# Altium project Board2.PrjPcb
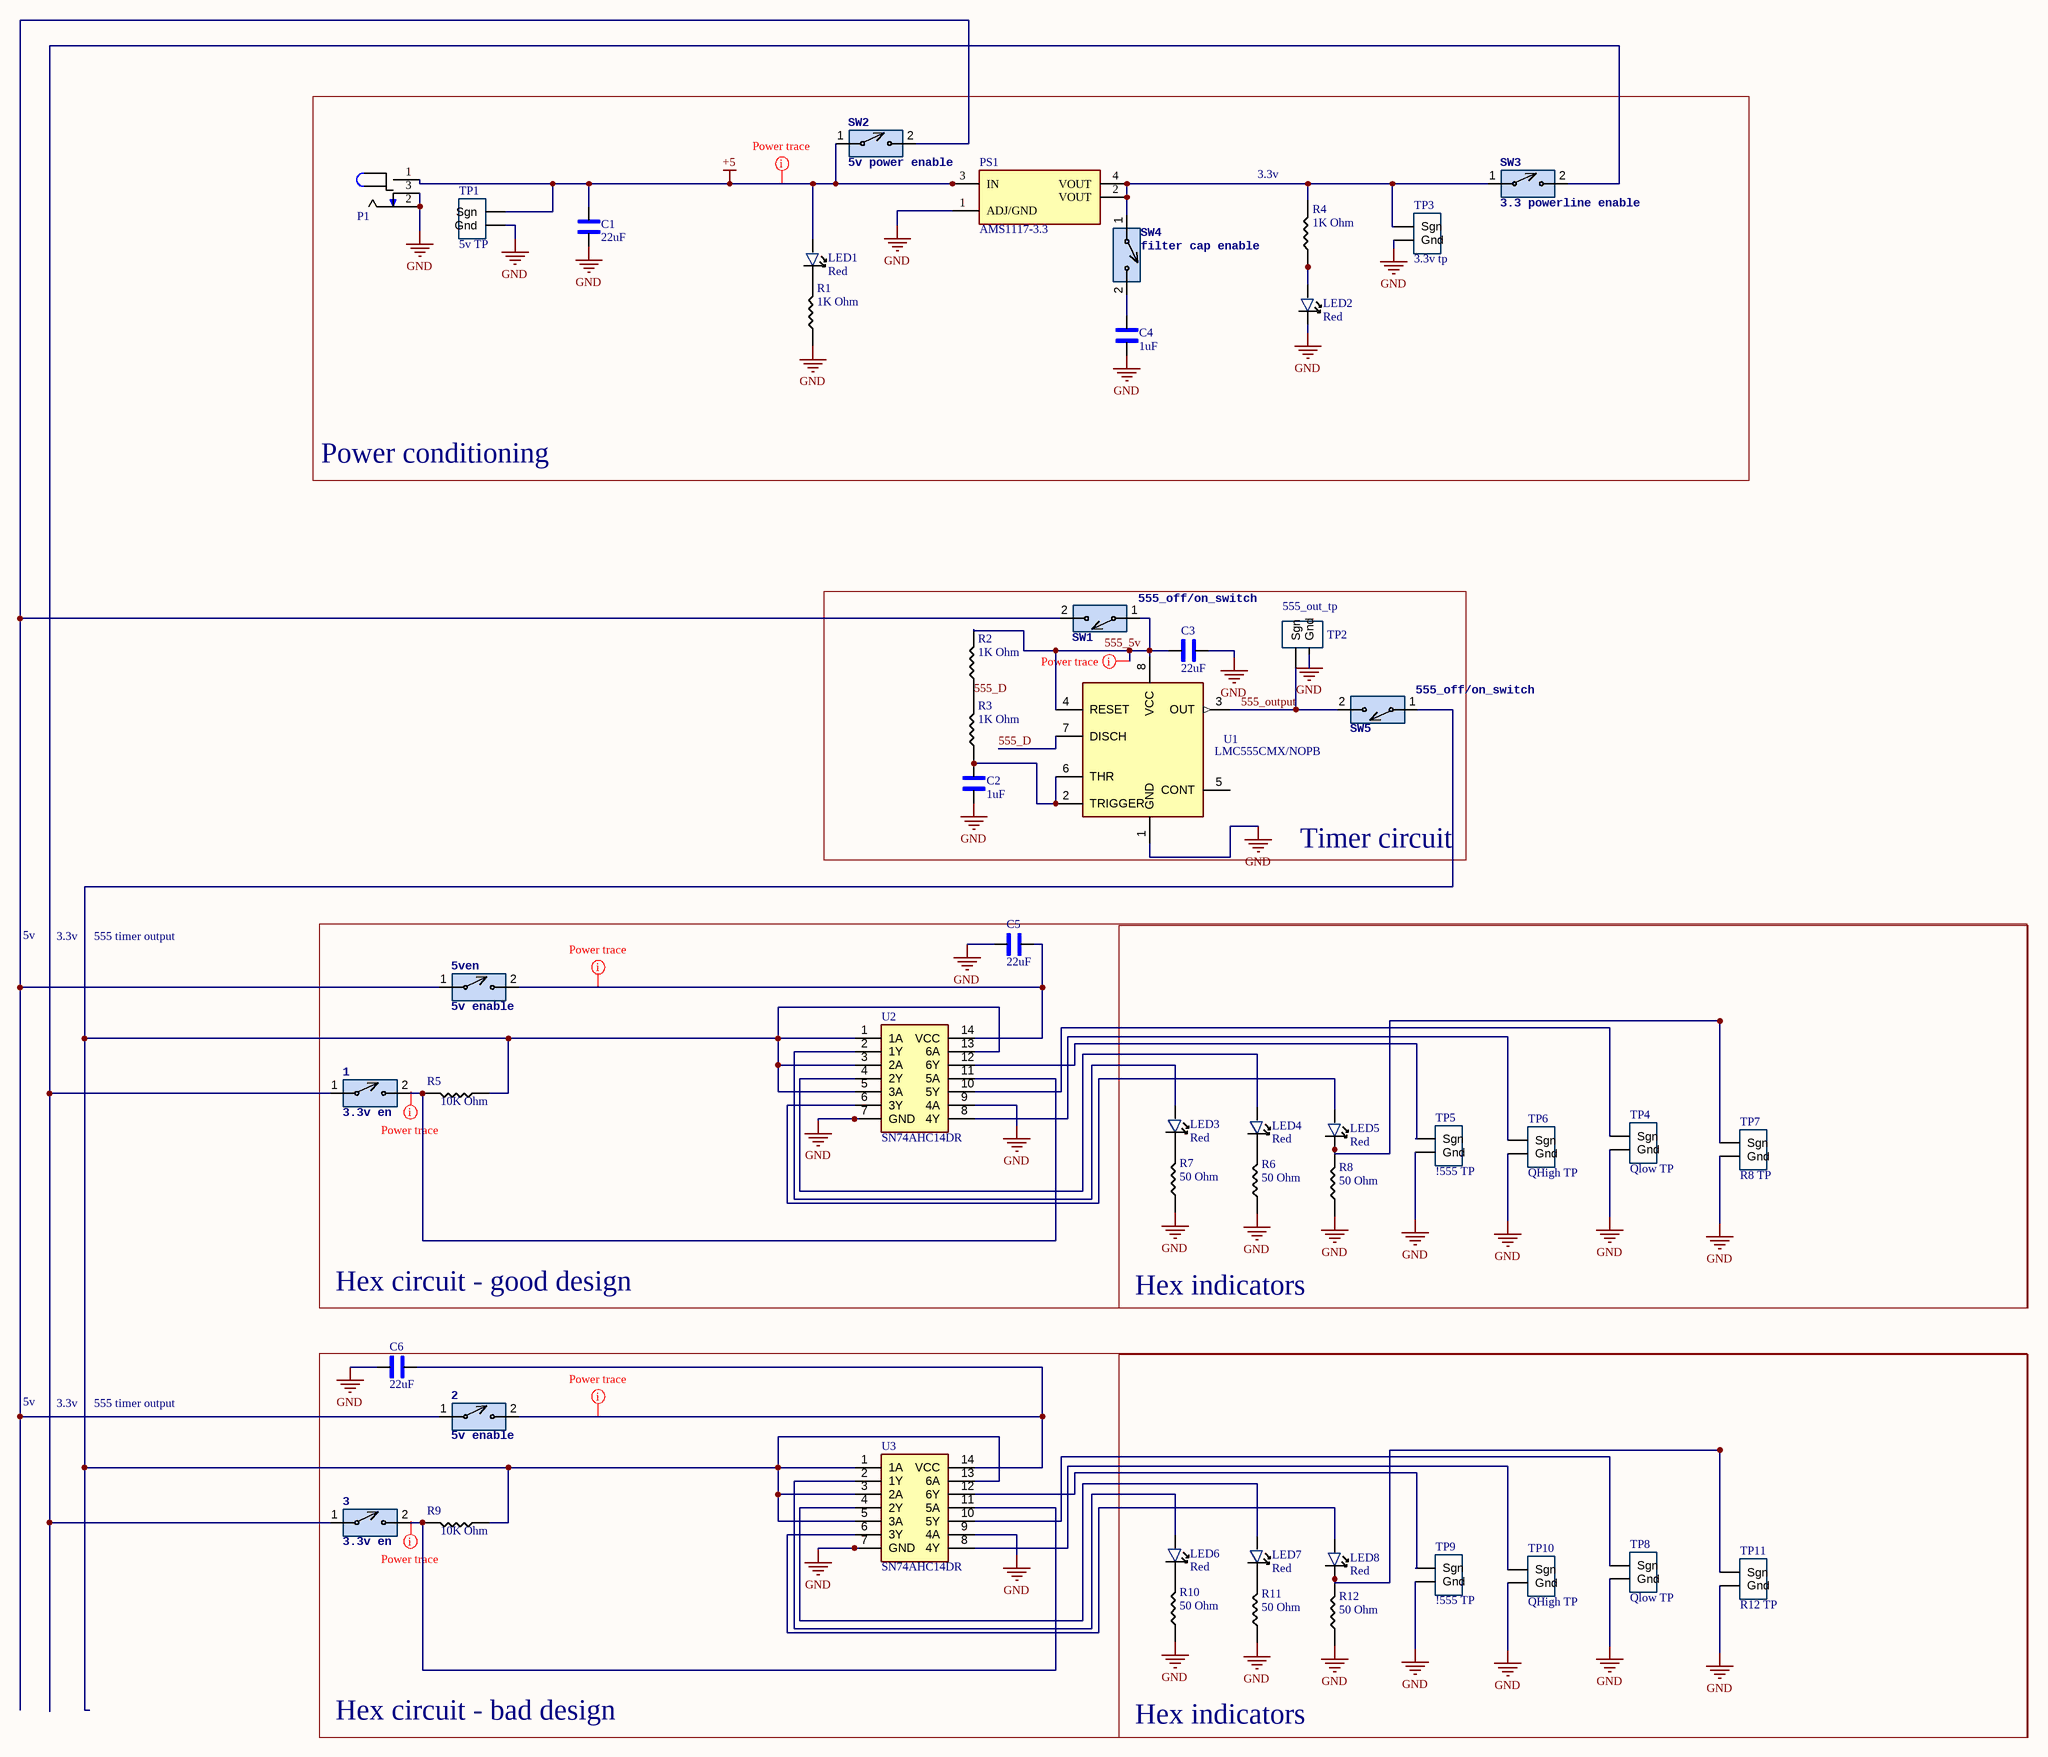
[diagram p0: Sheet1.SchDoc]
1 sheet, 51 parts. Net scope: global (net labels, ports and power ports of the same name join across sheets).
Board files: ECEN3730_brd2a_9-26-2024.PcbDoc, brd2.PcbDoc

## Sheet Sheet1.SchDoc
size 863 x 558 mm; SheetNumber: 1; SheetTotal: 1

### Parts
1  3.3v en  [2Pin-Header-Conn]
2  5v enable  [2Pin-Header-Conn]
3  3.3v en  [2Pin-Header-Conn]
5ven  5v enable  [2Pin-Header-Conn]
C1  22uF  [1206_Passive_Capacitor]
C2  1uF  [1206_Passive_Capacitor]
C3  22uF  [1206_Passive_Capacitor]
C4  1uF  [1206_Passive_Capacitor]
C5  22uF  [1206_Passive_Capacitor]
C6  22uF  [1206_Passive_Capacitor]
LED1  Red  [LED_1206]
LED2  Red  [LED_1206]
LED3  Red  [LED_1206]
LED4  Red  [LED_1206]
LED5  Red  [LED_1206]
LED6  Red  [LED_1206]
LED7  Red  [LED_1206]
LED8  Red  [LED_1206]
P1  Power Jack  [Power_Jack]  (value not drawn)
PS1  AMS1117-3.3  [LDO]
R1  value 1K Ohm  [1206_Passive_Resitor]  (hidden comment: 1k)
R2  value 1K Ohm  [1206_Passive_Resitor]  (hidden comment: 1k)
R3  value 1K Ohm  [1206_Passive_Resitor]  (hidden comment: 1k)
R4  value 1K Ohm  [1206_Passive_Resitor]  (hidden comment: 1k)
R5  value 10K Ohm  [1206_Passive_Resitor]  (hidden comment: 1k)
R6  value 50 Ohm  [1206_Passive_Resitor]
R7  value 50 Ohm  [1206_Passive_Resitor]
R8  value 50 Ohm  [1206_Passive_Resitor]
R9  value 10K Ohm  [1206_Passive_Resitor]  (hidden comment: 1k)
R10  value 50 Ohm  [1206_Passive_Resitor]
R11  value 50 Ohm  [1206_Passive_Resitor]
R12  value 50 Ohm  [1206_Passive_Resitor]
SW1  555_off/on_switch  [2Pin-Header-Conn]
SW2  5v power enable  [2Pin-Header-Conn]
SW3  3.3 powerline enable  [2Pin-Header-Conn]
SW4  filter cap enable  [2Pin-Header-Conn]
SW5  555_off/on_switch  [2Pin-Header-Conn]
TP1  5v TP  [TP10x_Probe]
TP2  555_out_tp  [TP10x_Probe]
TP3  3.3v tp  [TP10x_Probe]
TP4  Qlow TP  [TP10x_Probe]
TP5  !555 TP  [TP10x_Probe]
TP6  QHigh TP  [TP10x_Probe]
TP7  R8 TP  [TP10x_Probe]
TP8  Qlow TP  [TP10x_Probe]
TP9  !555 TP  [TP10x_Probe]
TP10  QHigh TP  [TP10x_Probe]
TP11  R12 TP  [TP10x_Probe]
U1  LMC555CMX/NOPB  [TS555IDTTR]
U2  SN74AHC14DR  [HEX_74AC14]
U3  SN74AHC14DR  [HEX_74AC14]

### Blocks framed on the sheet
Power conditioning: C1 C4 LED1 LED2 P1 PS1 R1 R4 SW2-SW4 TP1 TP3
Timer circuit: C2 C3 R2 R3 SW1 SW5 TP2 U1
Hex circuit - good design: 1 5ven C5 R5 U2
Hex indicators: LED3-LED5 R6-R8 TP4-TP7
Hex circuit - bad design: 2 3 C6 R9 U3
Hex indicators: LED6-LED8 R10-R12 TP8-TP11

### Nets
+5: C1.2 LED1.1 P1.1 PS1.3(IN) SW2.1 TP1.1(Sgn)
GND: C1.1 C2.1 C3.2 C4.1 C5.1 C6.1 LED2.2 P1.2 P1.3 PS1.1(ADJ/GND) R1.1 R6.1 R7.1 R8.1 R10.1 R11.1 R12.1 TP1.2(Gnd) TP2.2(Gnd) TP3.2(Gnd) TP4.2(Gnd) TP5.2(Gnd) TP6.2(Gnd) TP7.2(Gnd) TP8.2(Gnd) TP9.2(Gnd) TP10.2(Gnd) TP11.2(Gnd) U1.1(GND) U2.7(GND) U2.9(4A) U3.7(GND) U3.9(4A)
555_5v: C3.1 R2.2 SW1.1 U1.4(RESET) U1.8(VCC)
555_D: R2.1 R3.2 U1.7(DISCH)
555_output: SW5.2 TP2.1(Sgn) U1.3(OUT)
Net1_1: 1.1 3.1 SW3.2
Net1_2: 1.2 R5.2 U2.11(5A)
Net2_1: 2.1 5ven.1 SW1.2 SW2.2
Net2_2: 2.2 C6.2 U3.14(VCC)
Net3_2: 3.2 R9.2 U3.11(5A)
Net5ven_2: 5ven.2 C5.2 U2.14(VCC)
NetC2_2: C2.2 R3.1 U1.2(TRIGGER) U1.6(THR)
NetC4_2: C4.2 SW4.2
NetLED1_2: LED1.2 R1.2
NetLED2_1: LED2.1 R4.1
NetLED3_1: LED3.1 U2.2(1Y)
NetLED3_2: LED3.2 R7.2
NetLED4_1: LED4.1 U2.4(2Y)
NetLED4_2: LED4.2 R6.2
NetLED5_1: LED5.1 U2.6(3Y)
NetLED5_2: LED5.2 R8.2 TP7.1(Sgn)
NetLED6_1: LED6.1 U3.2(1Y)
NetLED6_2: LED6.2 R10.2
NetLED7_1: LED7.1 U3.4(2Y)
NetLED7_2: LED7.2 R11.2
NetLED8_1: LED8.1 U3.6(3Y)
NetLED8_2: LED8.2 R12.2 TP11.1(Sgn)
NetPS1_2: PS1.2(VOUT) PS1.4(VOUT) R4.2 SW3.1 SW4.1 TP3.1(Sgn)
NetR5_1: R5.1 R9.1 SW5.1 U2.1(1A) U2.3(2A) U2.5(3A) U2.13(6A) U3.1(1A) U3.3(2A) U3.5(3A) U3.13(6A)
NetTP4_1: TP4.1(Sgn) U2.10(5Y)
NetTP5_1: TP5.1(Sgn) U2.12(6Y)
NetTP6_1: TP6.1(Sgn) U2.8(4Y)
NetTP8_1: TP8.1(Sgn) U3.10(5Y)
NetTP9_1: TP9.1(Sgn) U3.12(6Y)
NetTP10_1: TP10.1(Sgn) U3.8(4Y)

Not connected (* = marked no-connect by the designer): U1 5(CONT)

### Layout directives
rule Width Constraint [Pref Width = 20mil    Min Width = 10mil    Max Width = 100mil]: 555_5v, (no net found under the mark), +5, Net2_2, Net5ven_2

### Notes on the sheet
- (near R4) 3.3v
- 5v
- 3.3v
- 555 timer output
- DWG. NO.
- REV.
- SHT.
- REVISION
- DESCRIPTION
- DATE
- APPROVED
- THIS DOCUMENT AND THE DATA DISCLOSED HEREIN OR HEREWITH IS THE PROPERTY OF ALTIUM LIMITED AND MAY BE FREELY DISTRIBUTED IN WHOLE. NO RIGHTS ARE RESERVED OR EXPRESS OR IMPLIED WARANTEE GIVEN.
- ENG:
- DSN:
- APPROVALS
- PROJECT
- DOCUMENT REVISION:
- DESIGN ITEM:
- CHK:
- BOM:
- REFERENCE DOCUMENTS
- PROJECT REVISION:
- TITLE
- FAB DWG:
- PCB DWG:
- ASSY DWG:
- SCALE:
- SIZE
- D
- CAGE CODE
- FILE NAME
- DWG NO.
- SHEET
- OF
- REV

### Library data of the parts
1-3 5ven SW1-SW5 = SW_2Pin_100mil_Switch: 2Pin Header; LCSC Part#: C124375; Type: Extended
C1 C3 C5 C6 = C_22uF_1206: 22uF ±10% 25V X5R 1206 Multilayer Ceramic Capacitors MLCC - SMD/SMT RoHS; MFR Part #: CL31A226KAHNNNE; Type: basic; LCSC Part#: C12891; Datasheet: https://datasheet.lcsc.com/lcsc/1811031514_Samsung-Electro-Mechanics-CL31A226KAHNNNE_C12891.pdf; Value: 22uF
C2 C4 = C_1uF_1206: MULTILAYER CERAMIC CAPACITORS MLCC - SMD/SMT 1UF 50V 1206 ROHS; MFR Part #: CL31B105KBHNNNE; Type: Basic; Digikey Link: https://www.digikey.com/product-detail/en/C1206C105M4RACTU/399-8150-1-ND/3471873/?itemSeq=304982366; LCSC Part#: C1848; Value: 1uF
LED1-LED8 = LED_RED_1206: Red 621~631nm 1206 Light Emitting Diodes (LED) RoHS; MFR Part #: 15-21/R6C-FQ1R1B/2T; Type: Extended; LCSC Part#: C93133; Datasheet: https://datasheet.lcsc.com/szlcsc/1811151241_Everlight-Elec-15-21-R6C-FQ1R1B-2T_C93133.pdf; Value: Red
P1 = P_Power Jack: Power Barrel Connector Jack 2.10mm ID (0.083"), 5.50mm OD (0.217") Through Hole, Right Angle; MFR Part #: PJ-102A; Value: CONN PWR JACK 2X5.5MM SOLDER; Digikey Link: https://www.digikey.com/product-detail/en/PJ-102A/CP-102A-ND/275425/?itemSeq=304982367; LCSC Part#: C136744; Type: Extended
PS1 = PS_AMS_LDO_3v3: LOW DROPOUT REGULATORS(LDO) POSITIVE FIXED 1.3V @ 800MA 15V 3.3V 1A SOT-223 ROHS; Value: IC REG LINEAR 3.3V 800MA SOT223; MFR Part #: AMS1117-3.3; LCSC Part#: C6186; Type: Basic
R1-R5 R9 = R_1K_1206: CHIP RESISTOR - SURFACE MOUNT 1KOHMS ±1% 1/4W 1206 ROHS; MFR Part #: RNCP1206FTD1K00CT; Digikey Link: https://www.digikey.com/product-detail/en/RNCP1206FTD1K00/RNCP1206FTD1K00CT-ND/2240675/?itemSeq=304982373; LCSC Part#: C4410; Type: Basic
R6-R8 R10-R12 = R_100M_1206_1: CHIP RESISTOR - SURFACE MOUNT 100MOHMS ±1% 1/4W 1206 ROHS; MFR Part #: 1206W4F1006T5E; Digikey Link: https://www.digikey.com/en/products/detail/stackpole-electronics-inc/HMC1206JT100M/1742855; LCSC Part#: C59781; Type: Extended part
TP1-TP11 = TP_10x_Probe: Test Point 300 mil centers
U1 = U_555_Fast: 555 Type, Timer/Oscillator _Single_ IC 3MHz 8-SO; Package: SOIC-8; MFR Part #: LMC555CMX/NOPB; DigiKey link: https://www.digikey.com/product-detail/en/texas-instruments/LMC555CMX-NOPB/LMC555CMX-NOPBCT-ND/1010550; LCSC Part#: C90760; Type: Extended
U2 U3 = U_74AHC14: Inverter IC 6 Channel Schmitt Trigger 14-SOIC; Datasheet: https://datasheet.lcsc.com/szlcsc/ON-Semicon-ON-74AC14SCX_C5482.pdf; MFR Part #: SN74AHC14DR; LCSC Part#: C6942; Type: Extended